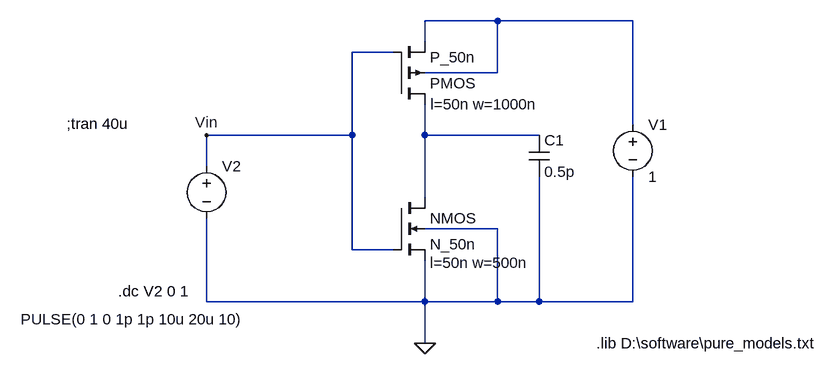
[diagram p0: schematic Lab2 power.asc]
Lab2 power.asc, the LTspice schematic file:
Version 4
SHEET 1 880 680
WIRE 336 32 224 32
WIRE 544 32 336 32
WIRE 224 64 224 32
WIRE 176 80 112 80
WIRE 336 112 336 32
WIRE 336 112 224 112
WIRE 544 192 544 32
WIRE 112 208 112 80
WIRE 112 208 -112 208
WIRE 224 208 224 160
WIRE 400 208 224 208
WIRE -112 256 -112 208
WIRE 224 304 224 208
WIRE 336 352 224 352
WIRE 112 384 112 208
WIRE 176 384 112 384
WIRE -112 464 -112 336
WIRE 224 464 224 400
WIRE 224 464 -112 464
WIRE 336 464 336 352
WIRE 336 464 224 464
WIRE 400 464 400 272
WIRE 400 464 336 464
WIRE 544 464 544 272
WIRE 544 464 400 464
WIRE 224 528 224 464
FLAG 224 528 0
FLAG -112 208 Vin
SYMBOL pmos4 176 160 M180
WINDOW 123 57 0 Left 2
SYMATTR InstName PMOS
SYMATTR Value P_50n
SYMATTR Value2 l=50n w=1000n
SYMBOL nmos4 176 304 R0
WINDOW 123 56 100 Left 2
SYMATTR InstName NMOS
SYMATTR Value N_50n
SYMATTR Value2 l=50n w=500n
SYMBOL voltage 544 176 R0
WINDOW 123 0 0 Left 0
WINDOW 39 0 0 Left 0
SYMATTR InstName V1
SYMATTR Value 1
SYMBOL voltage -112 240 R0
WINDOW 3 -286 251 Left 2
WINDOW 123 0 0 Left 0
WINDOW 39 0 0 Left 0
SYMATTR InstName V2
SYMATTR Value PULSE(0 1 0 1p 1p 10u 20u 10)
SYMBOL cap 384 208 R0
SYMATTR InstName C1
SYMATTR Value 0.5p
TEXT -327 190 Left 2 !;tran 40u
TEXT -248 448 Left 2 !.dc V2 0 1
TEXT 488 528 Left 2 !.lib D:\\software\\pure_models.txt

The netlist it stands for:
* Lab2 power.asc
M§PMOS N002 Vin N001 N001 P_50n l=50n w=1000n
M§NMOS N002 Vin 0 0 N_50n l=50n w=500n
V1 N001 0 1
V2 Vin 0 PULSE(0 1 0 1p 1p 10u 20u 10)
C1 N002 0 0.5p
.model NMOS NMOS
.model PMOS PMOS
.lib standard.mos
;tran 40u
.dc V2 0 1
.lib D:\software\pure_models.txt
.backanno
.end